# Altium schematic sheet main mcu.SchDoc
size A1; SheetNumber: 1; SheetTotal: 5
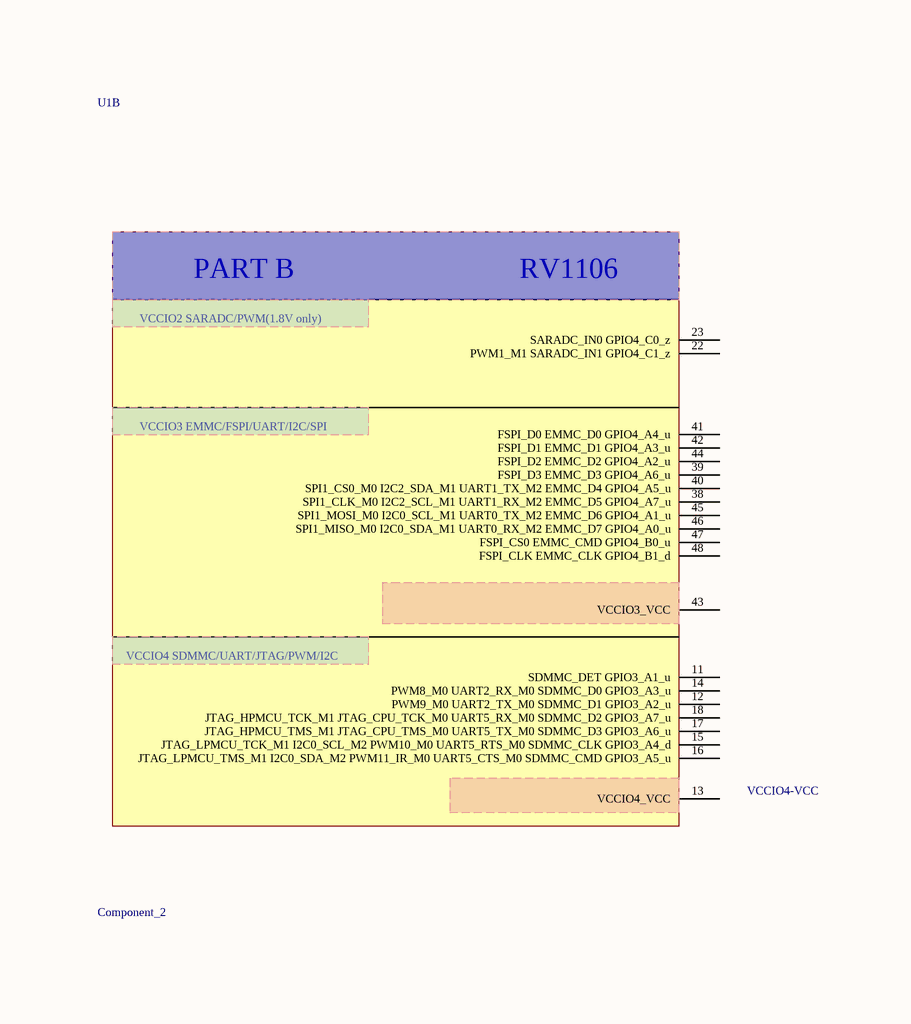
[diagram p0: main mcu.SchDoc, top left]
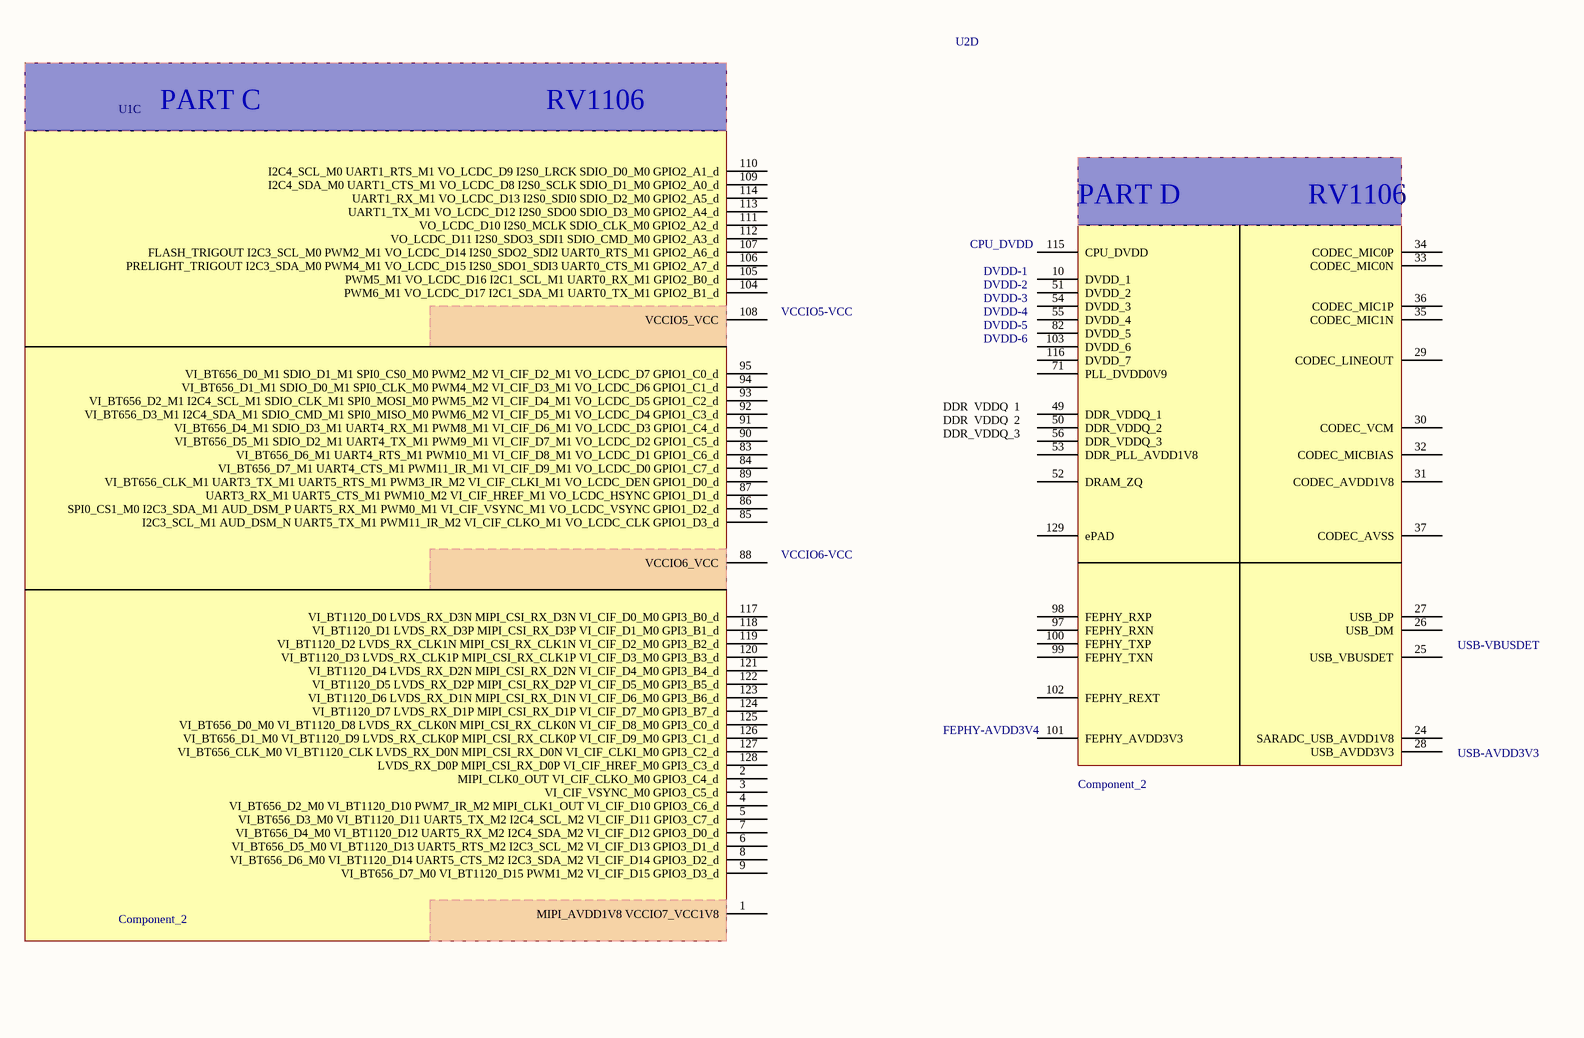
[diagram p1: main mcu.SchDoc, top right]
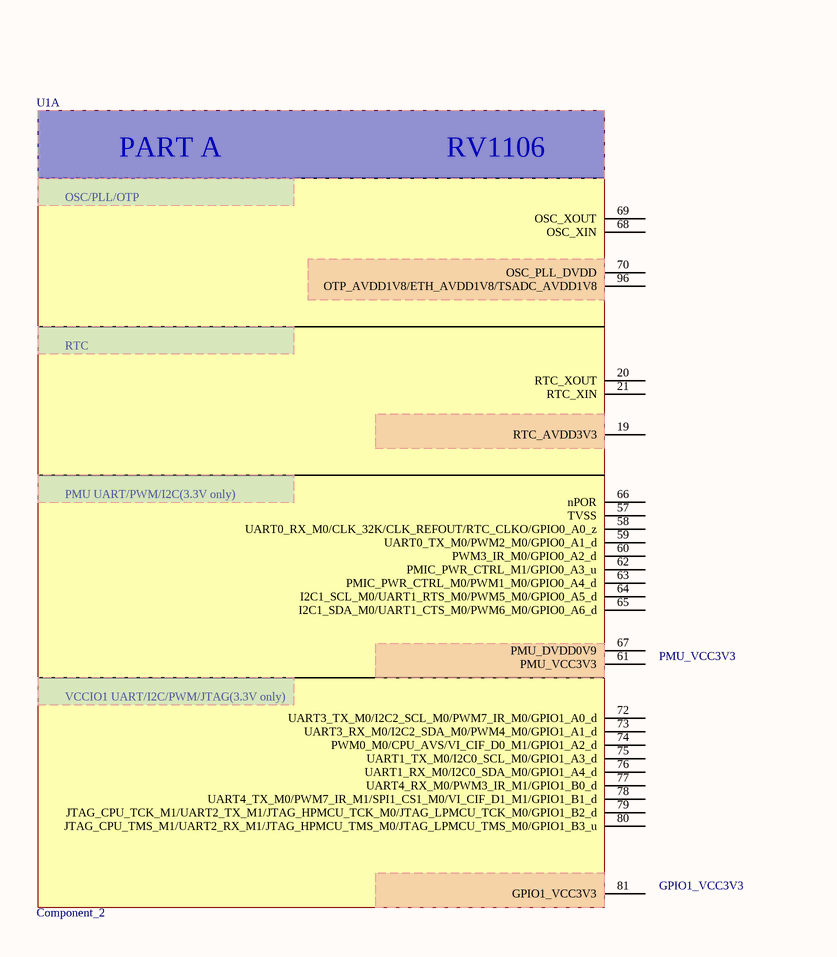
[diagram p2: main mcu.SchDoc, bottom left]

## Parts
U1  Component_2  [QFN35P1230X1230X90_HS-129N]  (parts A,B,C of 4)
U2  Component_2  [QFN35P1230X1230X90_HS-129N]  (part D of 4)

## Nets

Not connected (* = marked no-connect by the designer): U1 1(MIPI_AVDD1V8_VCCIO7_VCC1V8) 2(MIPI_CLK0_OUT_VI_CIF_CLKO_M0_GPIO3_C4_d) 3(VI_CIF_VSYNC_M0_GPIO3_C5_d) 4(VI_BT656_D2_M0_VI_BT1120_D10_PWM7_IR_M2_MIPI_CLK1_OUT_VI_CIF_D10_GPIO3_C6_d) 5(VI_BT656_D3_M0_VI_BT1120_D11_UART5_TX_M2_I2C4_SCL_M2_VI_CIF_D11_GPIO3_C7_d) 6(VI_BT656_D5_M0_VI_BT1120_D13_UART5_RTS_M2_I2C3_SCL_M2_VI_CIF_D13_GPIO3_D1_d) 7(VI_BT656_D4_M0_VI_BT1120_D12_UART5_RX_M2_I2C4_SDA_M2_VI_CIF_D12_GPIO3_D0_d) 8(VI_BT656_D6_M0_VI_BT1120_D14_UART5_CTS_M2_I2C3_SDA_M2_VI_CIF_D14_GPIO3_D2_d) 9(VI_BT656_D7_M0_VI_BT1120_D15_PWM1_M2_VI_CIF_D15_GPIO3_D3_d) 11(SDMMC_DET_GPIO3_A1_u) 12(PWM9_M0_UART2_TX_M0_SDMMC_D1_GPIO3_A2_u) 13(VCCIO4_VCC) 14(PWM8_M0_UART2_RX_M0_SDMMC_D0_GPIO3_A3_u) 15(JTAG_LPMCU_TCK_M1_I2C0_SCL_M2_PWM10_M0_UART5_RTS_M0_SDMMC_CLK_GPIO3_A4_d) 16(JTAG_LPMCU_TMS_M1_I2C0_SDA_M2_PWM11_IR_M0_UART5_CTS_M0_SDMMC_CMD_GPIO3_A5_u) 17(JTAG_HPMCU_TMS_M1_JTAG_CPU_TMS_M0_UART5_TX_M0_SDMMC_D3_GPIO3_A6_u) 18(JTAG_HPMCU_TCK_M1_JTAG_CPU_TCK_M0_UART5_RX_M0_SDMMC_D2_GPIO3_A7_u) 19(RTC_AVDD3V3) 20(RTC_XOUT) 21(RTC_XIN) 22(PWM1_M1_SARADC_IN1_GPIO4_C1_z) 23(SARADC_IN0_GPIO4_C0_z) 38(SPI1_CLK_M0_I2C2_SCL_M1_UART1_RX_M2_EMMC_D5_GPIO4_A7_u) 39(FSPI_D3_EMMC_D3_GPIO4_A6_u) 40(SPI1_CS0_M0_I2C2_SDA_M1_UART1_TX_M2_EMMC_D4_GPIO4_A5_u) 41(FSPI_D0_EMMC_D0_GPIO4_A4_u) 42(FSPI_D1_EMMC_D1_GPIO4_A3_u) 43(VCCIO3_VCC) 44(FSPI_D2_EMMC_D2_GPIO4_A2_u) 45(SPI1_MOSI_M0_I2C0_SCL_M1_UART0_TX_M2_EMMC_D6_GPIO4_A1_u) 46(SPI1_MISO_M0_I2C0_SDA_M1_UART0_RX_M2_EMMC_D7_GPIO4_A0_u) 47(FSPI_CS0_EMMC_CMD_GPIO4_B0_u) 48(FSPI_CLK_EMMC_CLK_GPIO4_B1_d) 57(TVSS) 58(UART0_RX_M0/CLK_32K/CLK_REFOUT/RTC_CLKO/GPIO0_A0_z) 59(UART0_TX_M0/PWM2_M0/GPIO0_A1_d) 60(PWM3_IR_M0/GPIO0_A2_d) 61(PMU_VCC3V3) 62(PMIC_PWR_CTRL_M1/GPIO0_A3_u) 63(PMIC_PWR_CTRL_M0/PWM1_M0/GPIO0_A4_d) 64(I2C1_SCL_M0/UART1_RTS_M0/PWM5_M0/GPIO0_A5_d) 65(I2C1_SDA_M0/UART1_CTS_M0/PWM6_M0/GPIO0_A6_d) 66(nPOR) 67(PMU_DVDD0V9) 68(OSC_XIN) 69(OSC_XOUT) 70(OSC_PLL_DVDD) 72(UART3_TX_M0/I2C2_SCL_M0/PWM7_IR_M0/GPIO1_A0_d) 73(UART3_RX_M0/I2C2_SDA_M0/PWM4_M0/GPIO1_A1_d) 74(PWM0_M0/CPU_AVS/VI_CIF_D0_M1/GPIO1_A2_d) 75(UART1_TX_M0/I2C0_SCL_M0/GPIO1_A3_d) 76(UART1_RX_M0/I2C0_SDA_M0/GPIO1_A4_d) 77(UART4_RX_M0/PWM3_IR_M1/GPIO1_B0_d) 78(UART4_TX_M0/PWM7_IR_M1/SPI1_CS1_M0/VI_CIF_D1_M1/GPIO1_B1_d) 79(JTAG_CPU_TCK_M1/UART2_TX_M1/JTAG_HPMCU_TCK_M0/JTAG_LPMCU_TCK_M0/GPIO1_B2_d) 80(JTAG_CPU_TMS_M1/UART2_RX_M1/JTAG_HPMCU_TMS_M0/JTAG_LPMCU_TMS_M0/GPIO1_B3_u) 81(GPIO1_VCC3V3) 83(VI_BT656_D6_M1_UART4_RTS_M1_PWM10_M1_VI_CIF_D8_M1_VO_LCDC_D1_GPIO1_C6_d) 84(VI_BT656_D7_M1_UART4_CTS_M1_PWM11_IR_M1_VI_CIF_D9_M1_VO_LCDC_D0_GPIO1_C7_d) 85(I2C3_SCL_M1_AUD_DSM_N_UART5_TX_M1_PWM11_IR_M2_VI_CIF_CLKO_M1_VO_LCDC_CLK_GPIO1_D3_d) 86(SPI0_CS1_M0_I2C3_SDA_M1_AUD_DSM_P_UART5_RX_M1_PWM0_M1_VI_CIF_VSYNC_M1_VO_LCDC_VSYNC_GPIO1_D2_d) 87(UART3_RX_M1_UART5_CTS_M1_PWM10_M2_VI_CIF_HREF_M1_VO_LCDC_HSYNC_GPIO1_D1_d) 88(VCCIO6_VCC) 89(VI_BT656_CLK_M1_UART3_TX_M1_UART5_RTS_M1_PWM3_IR_M2_VI_CIF_CLKI_M1_VO_LCDC_DEN_GPIO1_D0_d) 90(VI_BT656_D5_M1_SDIO_D2_M1_UART4_TX_M1_PWM9_M1_VI_CIF_D7_M1_VO_LCDC_D2_GPIO1_C5_d) 91(VI_BT656_D4_M1_SDIO_D3_M1_UART4_RX_M1_PWM8_M1_VI_CIF_D6_M1_VO_LCDC_D3_GPIO1_C4_d) 92(VI_BT656_D3_M1_I2C4_SDA_M1_SDIO_CMD_M1_SPI0_MISO_M0_PWM6_M2_VI_CIF_D5_M1_VO_LCDC_D4_GPIO1_C3_d) 93(VI_BT656_D2_M1_I2C4_SCL_M1_SDIO_CLK_M1_SPI0_MOSI_M0_PWM5_M2_VI_CIF_D4_M1_VO_LCDC_D5_GPIO1_C2_d) 94(VI_BT656_D1_M1_SDIO_D0_M1_SPI0_CLK_M0_PWM4_M2_VI_CIF_D3_M1_VO_LCDC_D6_GPIO1_C1_d) 95(VI_BT656_D0_M1_SDIO_D1_M1_SPI0_CS0_M0_PWM2_M2_VI_CIF_D2_M1_VO_LCDC_D7_GPIO1_C0_d) 96(OTP_AVDD1V8/ETH_AVDD1V8/TSADC_AVDD1V8) 104(PWM6_M1_VO_LCDC_D17_I2C1_SDA_M1_UART0_TX_M1_GPIO2_B1_d) 105(PWM5_M1_VO_LCDC_D16_I2C1_SCL_M1_UART0_RX_M1_GPIO2_B0_d) 106(PRELIGHT_TRIGOUT_I2C3_SDA_M0_PWM4_M1_VO_LCDC_D15_I2S0_SDO1_SDI3_UART0_CTS_M1_GPIO2_A7_d) 107(FLASH_TRIGOUT_I2C3_SCL_M0_PWM2_M1_VO_LCDC_D14_I2S0_SDO2_SDI2_UART0_RTS_M1_GPIO2_A6_d) 108(VCCIO5_VCC) 109(I2C4_SDA_M0_UART1_CTS_M1_VO_LCDC_D8_I2S0_SCLK_SDIO_D1_M0_GPIO2_A0_d) 110(I2C4_SCL_M0_UART1_RTS_M1_VO_LCDC_D9_I2S0_LRCK_SDIO_D0_M0_GPIO2_A1_d) 111(VO_LCDC_D10_I2S0_MCLK_SDIO_CLK_M0_GPIO2_A2_d) 112(VO_LCDC_D11_I2S0_SDO3_SDI1_SDIO_CMD_M0_GPIO2_A3_d) 113(UART1_TX_M1_VO_LCDC_D12_I2S0_SDO0_SDIO_D3_M0_GPIO2_A4_d) 114(UART1_RX_M1_VO_LCDC_D13_I2S0_SDI0_SDIO_D2_M0_GPIO2_A5_d) 117(VI_BT1120_D0_LVDS_RX_D3N_MIPI_CSI_RX_D3N_VI_CIF_D0_M0_GPI3_B0_d) 118(VI_BT1120_D1_LVDS_RX_D3P_MIPI_CSI_RX_D3P_VI_CIF_D1_M0_GPI3_B1_d) 119(VI_BT1120_D2_LVDS_RX_CLK1N_MIPI_CSI_RX_CLK1N_VI_CIF_D2_M0_GPI3_B2_d) 120(VI_BT1120_D3_LVDS_RX_CLK1P_MIPI_CSI_RX_CLK1P_VI_CIF_D3_M0_GPI3_B3_d) 121(VI_BT1120_D4_LVDS_RX_D2N_MIPI_CSI_RX_D2N_VI_CIF_D4_M0_GPI3_B4_d) 122(VI_BT1120_D5_LVDS_RX_D2P_MIPI_CSI_RX_D2P_VI_CIF_D5_M0_GPI3_B5_d) 123(VI_BT1120_D6_LVDS_RX_D1N_MIPI_CSI_RX_D1N_VI_CIF_D6_M0_GPI3_B6_d) 124(VI_BT1120_D7_LVDS_RX_D1P_MIPI_CSI_RX_D1P_VI_CIF_D7_M0_GPI3_B7_d) 125(VI_BT656_D0_M0_VI_BT1120_D8_LVDS_RX_CLK0N_MIPI_CSI_RX_CLK0N_VI_CIF_D8_M0_GPI3_C0_d) 126(VI_BT656_D1_M0_VI_BT1120_D9_LVDS_RX_CLK0P_MIPI_CSI_RX_CLK0P_VI_CIF_D9_M0_GPI3_C1_d) 127(VI_BT656_CLK_M0_VI_BT1120_CLK_LVDS_RX_D0N_MIPI_CSI_RX_D0N_VI_CIF_CLKI_M0_GPI3_C2_d) 128(LVDS_RX_D0P_MIPI_CSI_RX_D0P_VI_CIF_HREF_M0_GPI3_C3_d); U2 10(DVDD_1) 24(SARADC_USB_AVDD1V8) 25(USB_VBUSDET) 26(USB_DM) 27(USB_DP) 28(USB_AVDD3V3) 29(CODEC_LINEOUT) 30(CODEC_VCM) 31(CODEC_AVDD1V8) 32(CODEC_MICBIAS) 33(CODEC_MIC0N) 34(CODEC_MIC0P) 35(CODEC_MIC1N) 36(CODEC_MIC1P) 37(CODEC_AVSS) 49(DDR_VDDQ_1) 50(DDR_VDDQ_2) 51(DVDD_2) 52(DRAM_ZQ) 53(DDR_PLL_AVDD1V8) 54(DVDD_3) 55(DVDD_4) 56(DDR_VDDQ_3) 71(PLL_DVDD0V9) 82(DVDD_5) 97(FEPHY_RXN) 98(FEPHY_RXP) 99(FEPHY_TXN) 100(FEPHY_TXP) 101(FEPHY_AVDD3V3) 102(FEPHY_REXT) 103(DVDD_6) 115(CPU_DVDD) 116(DVDD_7) 129(ePAD)

## Notes on the sheet
- CPU_DVDD
- VCCIO5-VCC
- DVDD-1
- DVDD-5
- DVDD-2
- DVDD-3
- DVDD-4
- DVDD-6
- (near U2) DDR_VDDQ_1
- (near U2) DDR_VDDQ_2
- (near U2) DDR_VDDQ_3
- VCCIO6-VCC
- USB-VBUSDET
- FEPHY-AVDD3V4
- USB-AVDD3V3
- VCCIO4-VCC
- PMU_VCC3V3
- GPIO1_VCC3V3
- (in symbol Component_2, part A) PART A                              RV1106; OSC/PLL/OTP; RTC; PMU UART/PWM/I2C(3.3V only); VCCIO1 UART/I2C/PWM/JTAG(3.3V only)
- (in symbol Component_2, part B) PART B                              RV1106; VCCIO2 SARADC/PWM(1.8V only); VCCIO3 EMMC/FSPI/UART/I2C/SPI; VCCIO4 SDMMC/UART/JTAG/PWM/I2C
- (in symbol Component_2, part C) PART C                                      RV1106
- (in symbol Component_2, part D) PART D                 RV1106